# Altium project CANTRICK.PrjPcb
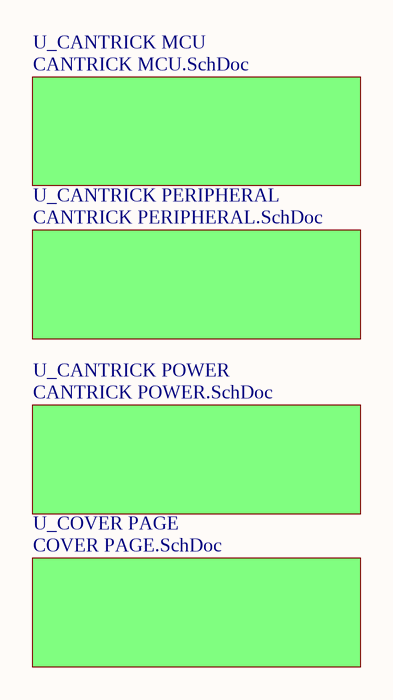
[diagram p0: OVERVIEW.SchDoc]
5 sheets, 104 parts. Net scope: flat (ports and power ports of the same name join across sheets).
Board file: CANTRICK.PcbDoc
Sheets:
  OVERVIEW.SchDoc
    U_CANTRICK MCU = CANTRICK MCU.SchDoc
    U_CANTRICK PERIPHERAL = CANTRICK PERIPHERAL.SchDoc
    U_CANTRICK POWER = CANTRICK POWER.SchDoc
    U_COVER PAGE = COVER PAGE.SchDoc

## Sheet OVERVIEW.SchDoc
size A4; SheetNumber: 1; SheetTotal: 5

### Sub-sheets
U_CANTRICK MCU = CANTRICK MCU.SchDoc: no entries
U_CANTRICK PERIPHERAL = CANTRICK PERIPHERAL.SchDoc: no entries
U_CANTRICK POWER = CANTRICK POWER.SchDoc: no entries
U_COVER PAGE = COVER PAGE.SchDoc: no entries

## Sheet CANTRICK MCU.SchDoc
size A4; SheetNumber: 4; SheetTotal: 5
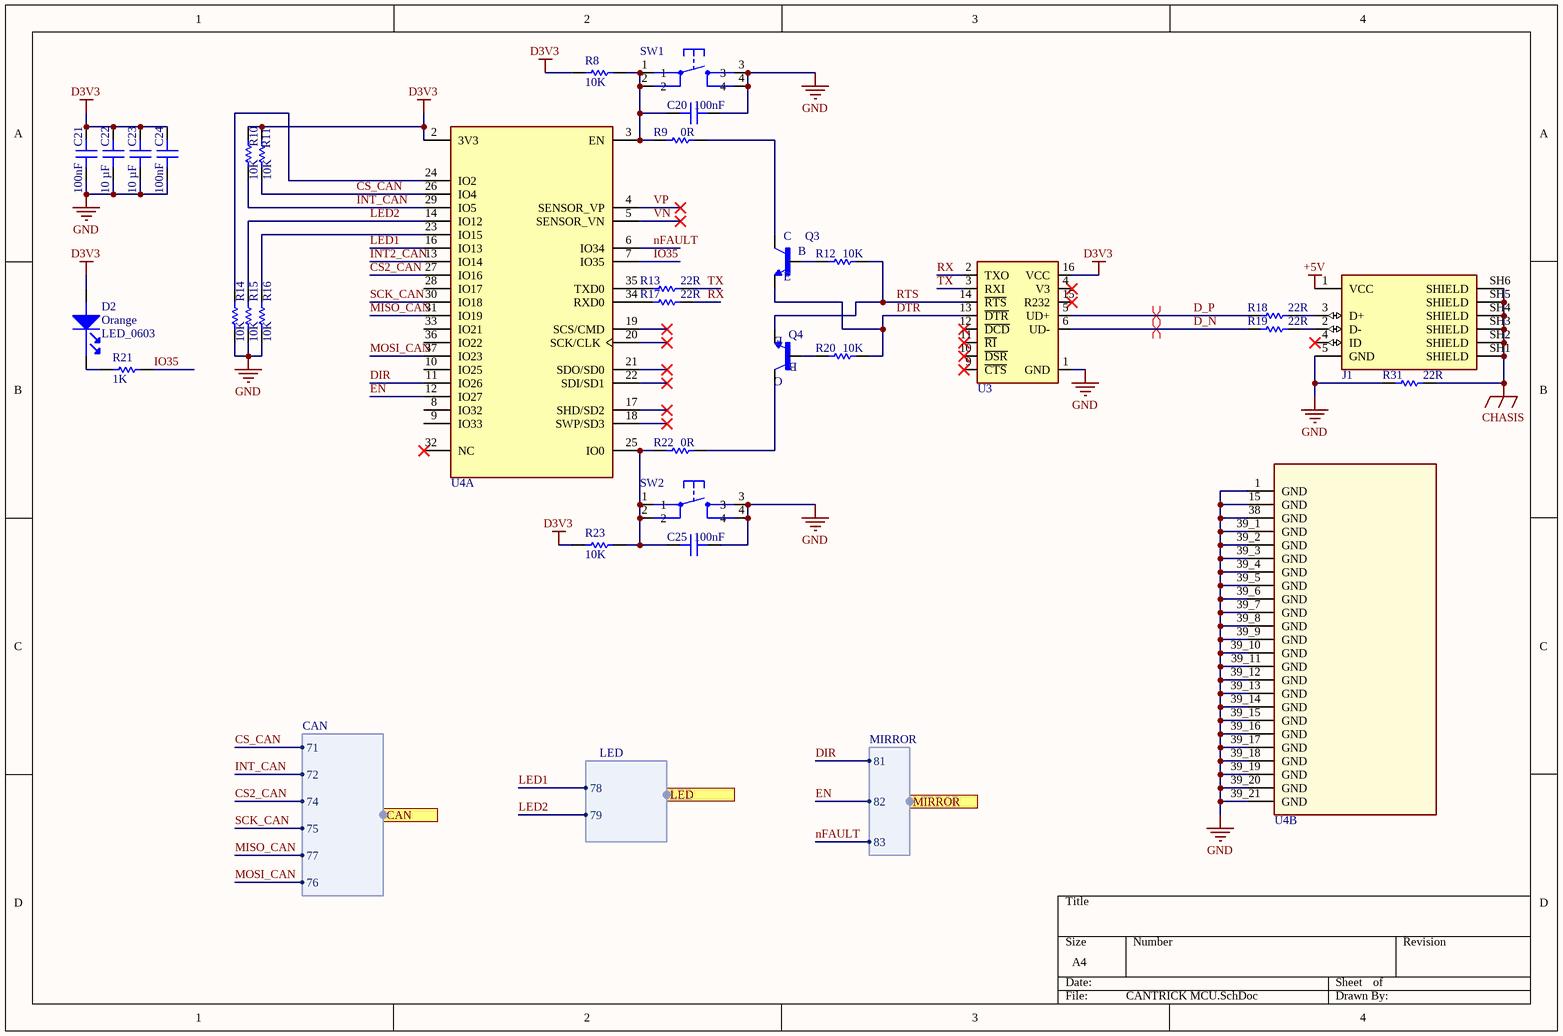
[diagram p1: CANTRICK MCU.SchDoc]

### Parts
C20  100nF  [CAP 0603]
C21  100nF  [CAP 0603]
C22  10 µF  [CAP 0603]
C23  10 µF  [CAP 0603]
C24  100nF  [CAP 0603]
C25  100nF  [CAP 0603]
D2  Orange  Package / Case: LED_0603  [LED]
J1  MICRO B  [MICRO USB B]  (value not drawn)
Q3  NMOS  [SOT23-3]  (value not drawn)
Q4  NMOS  [SOT23-3]  (value not drawn)
R8  10K  [Res 0603]
R9  0R  [Res 0603]
R10  10K  [Res 0603]
R11  10K  [Res 0603]
R12  10K  [Res 0603]
R13  22R  [Res 0603]
R14  10K  [Res 0603]
R15  10K  [Res 0603]
R16  10K  [Res 0603]
R17  22R  [Res 0603]
R18  22R  [Res 0603]
R19  22R  [Res 0603]
R20  10K  [Res 0603]
R21  1K  [Res 0603]
R22  0R  [Res 0603]
R23  10K  [Res 0603]
R31  22R  [Res 0603]
SW1  SW2  [SWITCH]  (value not drawn)
SW2  SW2  [SWITCH]  (value not drawn)
U3  CH340C  [CH340C]  (value not drawn)
U4  ESP32-WROOM-32UE-N8  [ESP32S]  (value not drawn)  (parts A,B of 2)

### Ports
CAN (harness CAN), LED (harness LED), MIRROR (harness MIRROR)

### Harnesses
CAN: 71, 72, 74, 75, 76, 77
LED: 78, 79
MIRROR: 81, 82, 83

### Nets
+5V: J1.1(VCC)
CHASIS: J1.SH1(SHIELD) J1.SH2(SHIELD) J1.SH3(SHIELD) J1.SH4(SHIELD) J1.SH5(SHIELD) J1.SH6(SHIELD) R31.2
D3V3: C21.2 C22.2 C23.2 C24.2 D2.1(ANODE) R8.1 R10.2 R11.2 R23.1 U3.16(VCC) U4.2(3V3)
GND: C20.1 C21.1 C22.1 C23.1 C24.1 C25.1 J1.5(GND) R14.1 R15.1 R16.1 R31.1 SW1.3 SW1.4 SW2.3 SW2.4 U3.1(GND) U4.1(GND) U4.15(GND) U4.38(GND) U4.39_1(GND) U4.39_2(GND) U4.39_3(GND) U4.39_4(GND) U4.39_5(GND) U4.39_6(GND) U4.39_7(GND) U4.39_8(GND) U4.39_9(GND) U4.39_10(GND) U4.39_11(GND) U4.39_12(GND) U4.39_13(GND) U4.39_14(GND) U4.39_15(GND) U4.39_16(GND) U4.39_17(GND) U4.39_18(GND) U4.39_19(GND) U4.39_20(GND) U4.39_21(GND)
CS2_CAN: U4.27(IO16) ; port CAN.74
CS_CAN: R11.1 U4.26(IO4) ; port CAN.71
D_N: R19.1 U3.6(UD-)
D_P: R18.1 U3.5(UD+)
DIR: U4.11(IO26) ; port MIRROR.81
DTR: Q3.2(E) R20.2 U3.13(~{DTR})
EN: U4.12(IO27) ; port MIRROR.82
INT2_CAN: U4.13(IO14)
INT_CAN: R10.1 U4.29(IO5) ; port CAN.72
IO35: R21.2 U4.7(IO35)
LED1: U4.16(IO13) ; port LED.78
LED2: R15.2 U4.14(IO12) ; port LED.79
MISO_CAN: U4.31(IO19) ; port CAN.77
MOSI_CAN: U4.37(IO23) ; port CAN.76
nFAULT: U4.6(IO34) ; port MIRROR.83
RTS: Q4.2(E) R12.2 U3.14(~{RTS})
RX: R17.2 U3.2(TXO)
SCK_CAN: U4.30(IO18) ; port CAN.75
TX: R13.2 U3.3(RXI)
VN: U4.5(SENSOR_VN)
VP: U4.4(SENSOR_VP)
NetC20_2: C20.2 R8.2 R9.1 SW1.1 SW1.2 U4.3(EN)
NetC25_2: C25.2 R22.1 R23.2 SW2.1 SW2.2 U4.25(IO0)
NetD2_2: D2.2(cathode) R21.1
NetJ1_2: J1.2(D-) R19.2
NetJ1_3: J1.3(D+) R18.2
NetQ3_1: Q3.1(B) R12.1
NetQ3_3: Q3.3(C) R9.2
NetQ4_1: Q4.1(B) R20.1
NetQ4_3: Q4.3(C) R22.2
NetR13_1: R13.1 U4.35(TXD0)
NetR14_2: R14.2 U4.24(IO2)
NetR16_2: R16.2 U4.23(IO15)
NetR17_1: R17.1 U4.34(RXD0)

Not connected (* = marked no-connect by the designer): J1 4(ID)*; U3 4(V3)* 9(~{CTS})* 10(~{DSR})* 11(~{RI})* 12(~{DCD})* 15(R232)*; U4 8(IO32) 9(IO33) 10(IO25) 17(SHD/SD2)* 18(SWP/SD3)* 19(SCS/CMD)* 20(SCK/CLK)* 21(SDO/SD0)* 22(SDI/SD1)* 28(IO17) 32(NC)* 33(IO21) 36(IO22)

### Layout directives
differential pair: D_N, D_P

### Library data of the parts
C20 C21 C24 C25 = GMC10X7R106K10NT: CAP0603 X7R 10UF 10% 10V; manufacturer: Cal-Chip Electronics, Inc.; Capacitance: 10 µF; Part Number: GMC10X7R106K10NT; Value: 100nF; Applications: General Purpose; componentlink1description: Datasheet; componentlink1url: https://88ce57.p3cdn1.secureserver.net/wp-content/uploads/2023/01/gmc_series-2.pdf; componentlink2description: DigiKey Link; componentlink2url: https://www.digikey.com/en/products/detail/cal-chip-electronics-inc/GMC10X7R106K10NT/18151126; Device Package: 0603 (1608 Metric); lastupdated: 2/9/2024 8:09:39 PM; Lifecycle Status: Active; Minimum Order: 1; Mounting Type: Surface Mount, MLCC; Operating Temperature: -55°C ~ 125°C; Package / Case: 0603 (1608 Metric); packaging: TapeAndReel; partid: 49835; Part Status: Active; price: 0.26; series: GMC; Size / Dimension: 0.063" L x 0.031" W (1.60mm x 0.80mm); Supplier 1: DigiKey; Supplier Part Number 1: 4713-GMC10X7R106K10NTCT-ND; Temperature Coefficient: X7R; Thickness (Max): 0.039" (1.00mm); Tolerance: ±10%; Voltage - Rated: 10V
C22 C23 = GMC10X7R106K10NT: CAP0603 X7R 10UF 10% 10V; manufacturer: Cal-Chip Electronics, Inc.; Part Number: GMC10X7R106K10NT; Value: 10 µF; Applications: General Purpose; Capacitance: 10 µF; componentlink1description: Datasheet; componentlink1url: https://88ce57.p3cdn1.secureserver.net/wp-content/uploads/2023/01/gmc_series-2.pdf; componentlink2description: DigiKey Link; componentlink2url: https://www.digikey.com/en/products/detail/cal-chip-electronics-inc/GMC10X7R106K10NT/18151126; Device Package: 0603 (1608 Metric); lastupdated: 2/9/2024 8:09:39 PM; Lifecycle Status: Active; Minimum Order: 1; Mounting Type: Surface Mount, MLCC; Operating Temperature: -55°C ~ 125°C; Package / Case: 0603 (1608 Metric); packaging: TapeAndReel; partid: 49835; Part Status: Active; price: 0.26; series: GMC; Size / Dimension: 0.063" L x 0.031" W (1.60mm x 0.80mm); Supplier 1: DigiKey; Supplier Part Number 1: 4713-GMC10X7R106K10NTCT-ND; Temperature Coefficient: X7R; Thickness (Max): 0.039" (1.00mm); Tolerance: ±10%; Voltage - Rated: 10V
D2 = LED ORANGE 606NM 0603: LED SMARTLED ORANGE 606NM 0603; Manufacturer: OSRAM Opto Semiconductors Inc; Manufacturer Part Number: LO L29K-H2K1-24-Z; Millicandela Rating: 6.3mcd; Voltage - Forward (Vf) Typ: 1.8V; Current - Test: 2mA; Wavelength - Peak: 610nm; Viewing Angle: 160°; Lens Type: Diffused; Lens Style/Size: Rectangle with Flat Top, 1.3mm x 0.8mm; Luminous Flux @ Current - Test: 25 mlm; By: Hieu.Nguyen_20191030; Supplier 1: Digi-Key; Supplier Part Number 1: 475-2740-1-ND; RoHS: RoHS Compliant; Category: Optoelectronics; Stock 1: 15900; Pricing 1: 1=0.17, 10=0.141, 100=0.1127, 250=0.0986, 500=0.09016 (USD); Color: Orange; Wavelength - Dominant: 606nm; Size / Dimension: 1.70mm L x 0.80mm W; Height: 0.65mm; Mounting Type: Surface Mount; Packaging: Cut Tape (CT); ComponentLink1URL: http://catalog.osram-os.com/catalogue/catalogue.do;jsessionid=302CF83AF637AE24E40AEB0ADA267EDD?act=downloadFile&favOid=020000010003f9de000100b6; ComponentLink1Description: http://catalog.osram-os.com/catalogue/catalogue.do;jsessionid=302CF83AF637AE24E40AEB0ADA267EDD?act=downloadFile&favOid=020000010003f9de000100b6
J1 = MICRO USB B
Q3 Q4 = MMBT3904: MMBT3904 Series 40 V CE Breakdown 0.2 A NPN General Purpose Amplifier - SOT-23; Manufacturer: onsemi; Collector Emitter Voltage (VCEO): 40V; hFE Min: 100; Max Power Dissipation: 350mW; Max Collector Current: 200mA; Transition Frequency: 300MHz; Collector Base Voltage (VCBO): 60V; Emitter Base Voltage (VEBO): 6V; Collector Emitter Saturation Voltage: 300mV; Supplier 1: Farnell; Manufacturer Part Number: MMBT3904; RoHS: Yes; Category: BJTs; Pricing 1: 5=0,136, 25=0,133, 100=0,0476, 250=0,0435, 500=0,043, 1000=0,022, 5000=0,02 (GBP); Mount: Surface Mount; Case/Package: SOT-23; Number of Pins: 3; Weight: 0.03g; Min Operating Temperature: -55°C; Max Operating Temperature: 150°C; Packaging: Tape and Reel; Polarity: NPN; Collector Emitter Breakdown Voltage: 40V; Voltage Rating (DC): 40V; Package Quantity: 1; Max Breakdown Voltage: 40V; Current Rating: 200mA; Series: -; Collector-emitter Voltage-Max: 300mV; Termination: SMD/SMT; Radiation Hardening: No; RoHS Compliant: Yes; Reach SVHC Compliant: No; Lead Free: Lead Free; Supplier Part Number 1: 9846727
R8-R23 R31 = Resistor 2.2K: Res Thick Film 0603 2.2K Ohm 5% 1/10W ±200ppm/°C Molded SMD SMD Paper T/R; Manufacturer: Vishay; Manufacturer Part Number: CRCW06032K20JNEA; Resistance: 2.2kR; Power Rating: 100mW; Voltage Rating: 75V; Supplier 1: Arrow Electronics; RoHS: Yes; Category: Chip SMD Resistors; Stock 1: 130000; Pricing 1: 5000=0.0053 (USD); Case/Package: 0603; Weight: 7.1E-05oz; Case Code (Metric): 1608; Case Code (Imperial): 0603; Contact Plating: Tin; Size Code: 0603; Min Operating Temperature: -55°C; Max Operating Temperature: 155°C; Package Quantity: 5000; Tolerance: 5%; Packaging: Tape and Reel; Resistor Type: Thick Film; Number of Terminations: 2; Temperature Coefficient: 200ppm/°C; Termination: SMD/SMT; Max Power Dissipation: 100mW; Features: Automotive AEC-Q200; Series: CRCW; Resistance Tolerance: 5%; Construction: Rectangular; Length: 1.55mm; Width: 0.85mm; Height: 0.45mm; Depth: 0.85mm; Ratings: AEC-Q200; Radiation Hardening: No; Military Standard: Not; RoHS Compliant: Yes; Reach SVHC Compliant: Unknown; Lead Free: 5697LeadFree; ComponentLink1URL: https://datasheet.ciiva.com/2462/dcrcwe3-2462048.pdf?src-supplier=Digikey; ComponentLink1Description: https://datasheet.ciiva.com/2462/dcrcwe3-2462048.pdf?src-supplier=Digikey; ComponentLink2URL: https://datasheet.ciiva.com/16767/70201119-16767464.pdf?src-supplier=Allied+Electronics; ComponentLink2Description: https://datasheet.ciiva.com/16767/70201119-16767464.pdf?src-supplier=Allied+Electronics; ComponentLink3URL: https://datasheet.ciiva.com/2462/dcrcwe3-2462046.pdf?src-supplier=Digikey; ComponentLink3Description: https://datasheet.ciiva.com/2462/dcrcwe3-2462046.pdf?src-supplier=Digikey; ComponentLink4URL: https://datasheet.ciiva.com/5541/dcrcwe3-109170-5541959.pdf?src-supplier=Mouser; ComponentLink4Description: https://datasheet.ciiva.com/5541/dcrcwe3-109170-5541959.pdf?src-supplier=Mouser; ComponentLink5URL: https://datasheet.ciiva.com/16286/dcrcwe3-16286997.pdf?src-supplier=Future+Electronics; ComponentLink5Description: https://datasheet.ciiva.com/16286/dcrcwe3-16286997.pdf?src-supplier=Future+Electronics; Supplier Part Number 1: CRCW06032K20JNEA
SW1 SW2 = SW2: Switch button 4 pin
U4 = ESP32-WROOM-32UE-N8: Multiprotocol Modules SMD module ESP32-WROOM-32UE, ESP32-D0WD-V3, ESP32 ECO V3,; Manufacturer: Espressif Systems; Supplier 1: Digikey; Manufacturer Part Number: ESP32-WROOM-32UE-N8; RoHS: No; Category: LDO; Stock 1: 3266; Pricing 1: 1=5,28, 10=4,566, 25=4,3196, 100=3,9802, 250=3,7768 (USD); ComponentLink1URL: https://datasheet.octopart.com/ESP32-WROOM-32UE-N8-Espressif-Systems-datasheet-188867343.pdf?src-supplier=TME; ComponentLink1Description: https://datasheet.octopart.com/ESP32-WROOM-32UE-N8-Espressif-Systems-datasheet-188867343.pdf?src-supplier=TME; Supplier Part Number 1: 1965-ESP32-WROOM-32UE-N8CT-ND

## Sheet CANTRICK PERIPHERAL.SchDoc
size A4; SheetNumber: 5; SheetTotal: 5
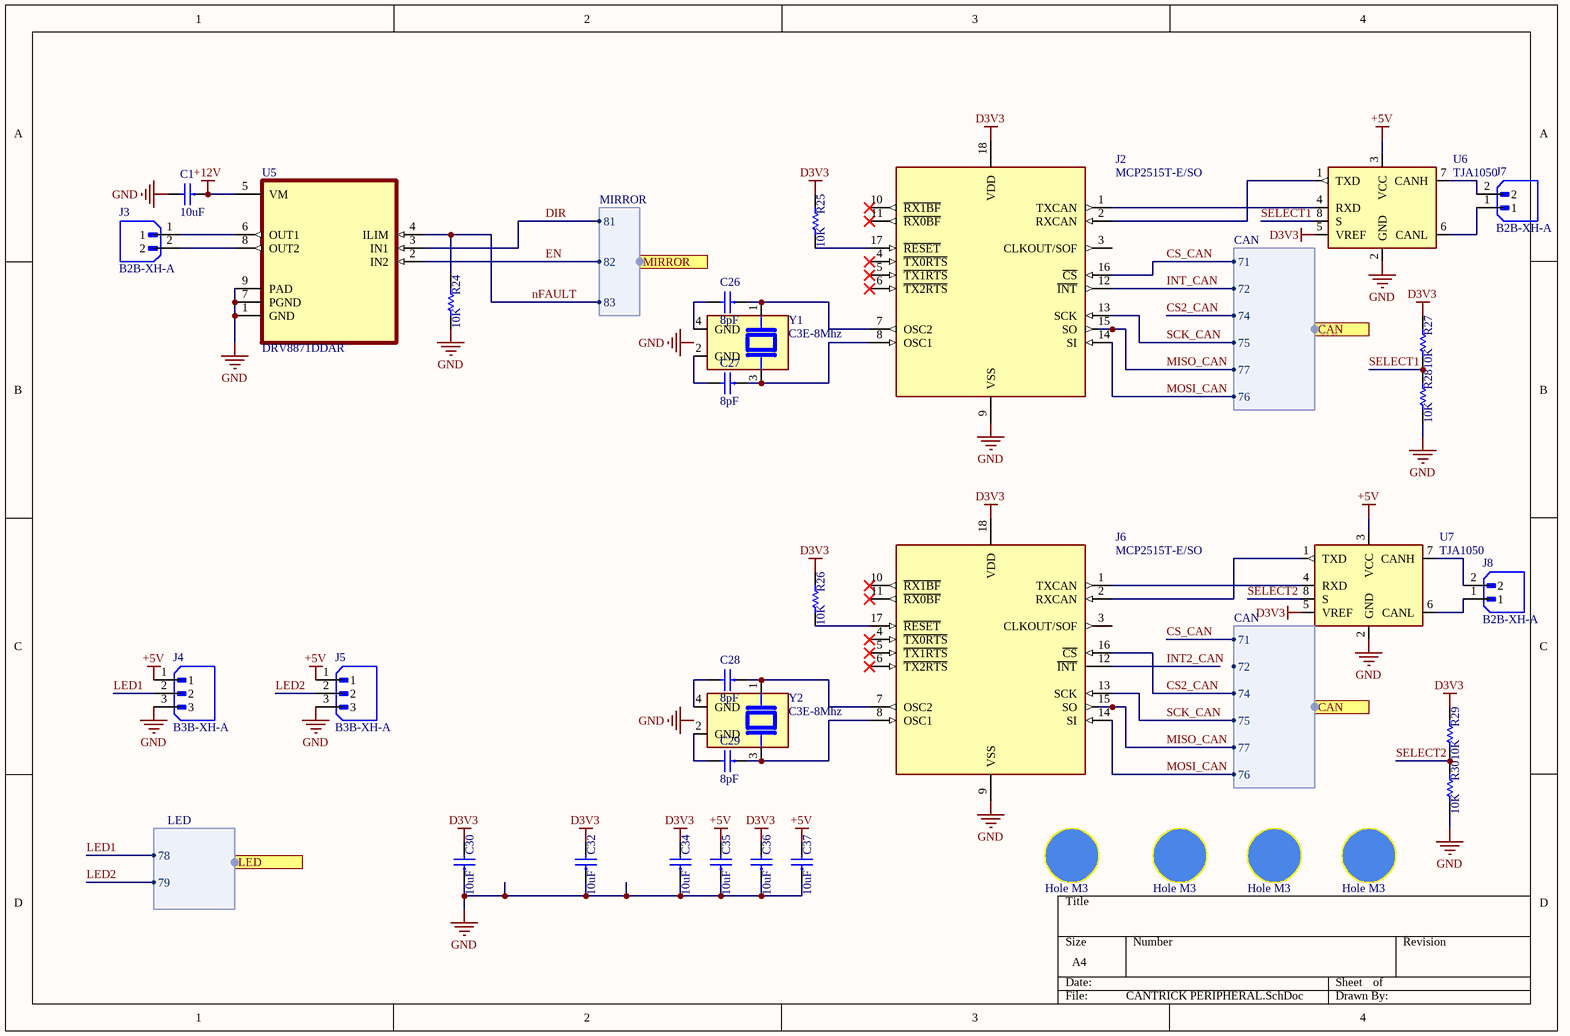
[diagram p2: CANTRICK PERIPHERAL.SchDoc]

### Parts
*1  Hole M3  [M3]
*2  Hole M3  [M3]
*3  Hole M3  [M3]
*4  Hole M3  [M3]
C1  10uF  [CAP-CER0603-0.8H]
C26  8pF  [CAP-CER0402-0.5H]
C27  8pF  [CAP-CER0402-0.5H]
C28  8pF  [CAP-CER0402-0.5H]
C29  8pF  [CAP-CER0402-0.5H]
C30  10uF  [CAP-CER0603-0.8H]
C32  10uF  [CAP-CER0603-0.8H]
C34  10uF  [CAP-CER0603-0.8H]
C35  10uF  [CAP-CER0603-0.8H]
C36  10uF  [CAP-CER0603-0.8H]
C37  10uF  [CAP-CER0603-0.8H]
J2  MCP2515T-E/SO  [SOIC127P1030X265-18N]
J3  B2B-XH-A  [JST_B2B-XH-A]
J4  B3B-XH-A  [JST_B3B-XH-A]
J5  B3B-XH-A  [JST_B3B-XH-A]
J6  MCP2515T-E/SO  [SOIC127P1030X265-18N]
J7  B2B-XH-A  [JST_B2B-XH-A]
J8  B2B-XH-A  [JST_B2B-XH-A]
R24  10K  [Res 0603]
R25  10K  [Res 0603]
R26  10K  [Res 0603]
R27  10K  [Res 0603]
R28  10K  [Res 0603]
R29  10K  [Res 0603]
R30  10K  [Res 0603]
U5  DRV8871DDAR  [VREG_LM5017MR/NOPB]
U6  TJA1050  [SOT96-1]
U7  TJA1050  [SOT96-1]
Y1  C3E-8Mhz  [XTAL_C3E-8.000-8-1015-R]
Y2  C3E-8Mhz  [XTAL_C3E-8.000-8-1015-R]

### Ports
CAN (harness CAN), LED (harness LED), MIRROR (harness MIRROR)

### Harnesses
CAN: 71, 72, 74, 75, 76, 77
LED: 78, 79
MIRROR: 81, 82, 83

### Nets
+5V: C35.2 C37.2 J4.1 J5.1 U6.3(VCC) U7.3(VCC)
+12V: C1.1 U5.5(VM)
D3V3: C30.2 C32.2 C34.2 C36.2 J2.18(VDD) J6.18(VDD) R25.2 R26.2 R27.2 R29.2 U6.5(VREF) U7.5(VREF)
GND: C1.2 C30.1 C32.1 C34.1 C35.1 C36.1 C37.1 J2.9(VSS) J4.3 J5.3 J6.9(VSS) R24.1 R28.1 R30.1 U5.1(GND) U5.7(PGND) U5.9(PAD) U6.2(GND) U7.2(GND)
CS2_CAN: J6.16(~{CS}) ; port CAN.74
CS_CAN: J2.16(~{CS}) ; port CAN.71
DIR: U5.3(IN1) ; port MIRROR.81
EN: U5.2(IN2) ; port MIRROR.82
INT2_CAN: J6.12(~{INT})
INT_CAN: J2.12(~{INT}) ; port CAN.72
LED1: J4.2 ; port LED.78
LED2: J5.2 ; port LED.79
MISO_CAN: J2.15(SO) J6.15(SO) ; port CAN.77
MOSI_CAN: J2.14(SI) J6.14(SI) ; port CAN.76
nFAULT: R24.2 U5.4(ILIM) ; port MIRROR.83
SCK_CAN: J2.13(SCK) J6.13(SCK) ; port CAN.75
SELECT1: R27.1 R28.2 U6.8(S)
SELECT2: R29.1 R30.2 U7.8(S)
NetC26_1: C26.1 J2.7(OSC2) Y1.1
NetC26_2: C26.2 Y1.4(GND)
NetC27_1: C27.1 J2.8(OSC1) Y1.3
NetC27_2: C27.2 Y1.2(GND)
NetC28_1: C28.1 J6.7(OSC2) Y2.1
NetC28_2: C28.2 Y2.4(GND)
NetC29_1: C29.1 J6.8(OSC1) Y2.3
NetC29_2: C29.2 Y2.2(GND)
NetJ2_1: J2.1(TXCAN) U6.4(RXD)
NetJ2_2: J2.2(RXCAN) U6.1(TXD)
NetJ2_17: J2.17(~{RESET}) R25.1
NetJ3_1: J3.1 U5.6(OUT1)
NetJ3_2: J3.2 U5.8(OUT2)
NetJ6_1: J6.1(TXCAN) U7.4(RXD)
NetJ6_2: J6.2(RXCAN) U7.1(TXD)
NetJ6_17: J6.17(~{RESET}) R26.1
NetJ7_1: J7.1 U6.6(CANL)
NetJ7_2: J7.2 U6.7(CANH)
NetJ8_1: J8.1 U7.6(CANL)
NetJ8_2: J8.2 U7.7(CANH)

Not connected (* = marked no-connect by the designer): J2 3(CLKOUT/SOF) 4(~{TX0RTS})* 5(~{TX1RTS})* 6(~{TX2RTS})* 10(~{RX1BF})* 11(~{RX0BF})*; J6 3(CLKOUT/SOF) 4(~{TX0RTS})* 5(~{TX1RTS})* 6(~{TX2RTS})* 10(~{RX1BF})* 11(~{RX0BF})*

### Notes on the sheet
- Labels drawn without touching a wire or pin: GND

### Library data of the parts
C1 C30 C32 C34-C37 = CAPCER0001 100nF 10% 50V X7R 0603 SMD: CAP CER 100nF 10% 50V X7R 0603 SMD; LINE: SMT; TYPE: EP; UNIT: PCS; TMG CODE: None; CERTIFICATION: NA; CLASS: B; MOUNT: SMD; TMG PN: CAPCER0001; ComponentLink1Description: Datasheet; ComponentLink1URL: https://datasheet.lcsc.com/lcsc/1811021431_Samsung-Electro-Mechanics-CL10B104KB8NNNC_C1591.pdf; Footprint: 0603
C26-C29 = CAPCER0013 100nF 10% 50V X7R 0402 SMD: CAP CER 100nF 10% 50V X7R 0402 SMD; LINE: SMT; TYPE: EP; UNIT: PCS; TMG CODE: None; CERTIFICATION: NA; CLASS: B; MOUNT: SMD; TMG PN: CAPCER0013; ComponentLink1Description: Datasheet; ComponentLink1URL: https://datasheet.lcsc.com/lcsc/1811021431_Samsung-Electro-Mechanics-CL10B104KB8NNNC_C1591.pdf; Footprint: 0402
J2 J6 = MCP2515T-E/SO: CAN controller w/ SPI interface, 125 deg C18 SOIC .300in T/R | Microchip Technology Inc. MCP2515T-E/SO; SnapEDA_Link: https://www.snapeda.com/parts/MCP2515T-E/SO/Microchip/view-part/?ref=snap; Package: SOIC-18 Microchip; Value: *; MF: Microchip; MP: MCP2515T-E/SO; Check_prices: https://www.snapeda.com/parts/MCP2515T-E/SO/Microchip/view-part/?ref=eda
J3 J7 J8 = B2B-XH-A: MF: {'manufacturer': u'JST Sales America Inc.'}; Package: None; Price: None; Value: *; MP: B2B-XH-A; Availability: Unavailable
J4 J5 = B3B-XH-A: Connector Header Through Hole 3 position 0.098 (2.50mm); MF: JST Sales; SnapEDA_Link: https://www.snapeda.com/parts/B3B-XH-A/JST+Sales+America+Inc./view-part/?ref=snap; Package: None; Value: *; MP: B3B-XH-A; Check_prices: https://www.snapeda.com/parts/B3B-XH-A/JST+Sales+America+Inc./view-part/?ref=eda
R24-R30 = Resistor 2.2K: as R8 on sheet CANTRICK MCU; Supplier 1: Arrow Electronics; RoHS: Yes; Category: Chip SMD Resistors; Stock 1: 130000; Pricing 1: 5000=0.0053 (USD); Case/Package: 0603; Weight: 7.1E-05oz; Case Code (Metric): 1608; Case Code (Imperial): 0603; Contact Plating: Tin; Size Code: 0603; Min Operating Temperature: -55°C; Max Operating Temperature: 155°C; Package Quantity: 5000; Tolerance: 5%; Packaging: Tape and Reel; Resistor Type: Thick Film; Number of Terminations: 2; Temperature Coefficient: 200ppm/°C; Termination: SMD/SMT; Max Power Dissipation: 100mW; Features: Automotive AEC-Q200; Series: CRCW; Resistance Tolerance: 5%; Construction: Rectangular; Length: 1.55mm; Width: 0.85mm; Height: 0.45mm; Depth: 0.85mm; Ratings: AEC-Q200; Radiation Hardening: No; Military Standard: Not; RoHS Compliant: Yes; Reach SVHC Compliant: Unknown; Lead Free: 5697LeadFree; ComponentLink1URL: https://datasheet.ciiva.com/2462/dcrcwe3-2462048.pdf?src-supplier=Digikey; ComponentLink1Description: https://datasheet.ciiva.com/2462/dcrcwe3-2462048.pdf?src-supplier=Digikey; ComponentLink2URL: https://datasheet.ciiva.com/16767/70201119-16767464.pdf?src-supplier=Allied+Electronics; ComponentLink2Description: https://datasheet.ciiva.com/16767/70201119-16767464.pdf?src-supplier=Allied+Electronics; ComponentLink3URL: https://datasheet.ciiva.com/2462/dcrcwe3-2462046.pdf?src-supplier=Digikey; ComponentLink3Description: https://datasheet.ciiva.com/2462/dcrcwe3-2462046.pdf?src-supplier=Digikey; ComponentLink4URL: https://datasheet.ciiva.com/5541/dcrcwe3-109170-5541959.pdf?src-supplier=Mouser; ComponentLink4Description: https://datasheet.ciiva.com/5541/dcrcwe3-109170-5541959.pdf?src-supplier=Mouser; ComponentLink5URL: https://datasheet.ciiva.com/16286/dcrcwe3-16286997.pdf?src-supplier=Future+Electronics; ComponentLink5Description: https://datasheet.ciiva.com/16286/dcrcwe3-16286997.pdf?src-supplier=Future+Electronics; Supplier Part Number 1: CRCW06032K20JNEA
U5 = DRV8871DDAR: 50-V, 3.6-A H-bridge motor driver with integrated current sensing; MF: Texas Instruments; SnapEDA_Link: https://www.snapeda.com/parts/DRV8871DDAR/Texas+Instruments/view-part/?ref=snap; Package: HSOIC-8 Texas Instruments; Value: *; MP: DRV8871DDAR; Check_prices: https://www.snapeda.com/parts/DRV8871DDAR/Texas+Instruments/view-part/?ref=eda
U6 U7 = TJA1050: CAN 1MBd Silent 5V Automotive 8-Pin SO T/R; MF: NXP Semiconductors; SnapEDA_Link: https://www.snapeda.com/parts/TJA1050/NXP+Semiconductors/view-part/?ref=snap; Package: None; Value: *; MP: TJA1050; Check_prices: https://www.snapeda.com/parts/TJA1050/NXP+Semiconductors/view-part/?ref=eda
Y1 Y2 = C3E-8.000-8-1015-R: Package: None; Price: None; Value: *; MP: C3E-8.000-8-1015-R; Availability: Unavailable

## Sheet CANTRICK POWER.SchDoc
size A4; SheetNumber: 3; SheetTotal: 5
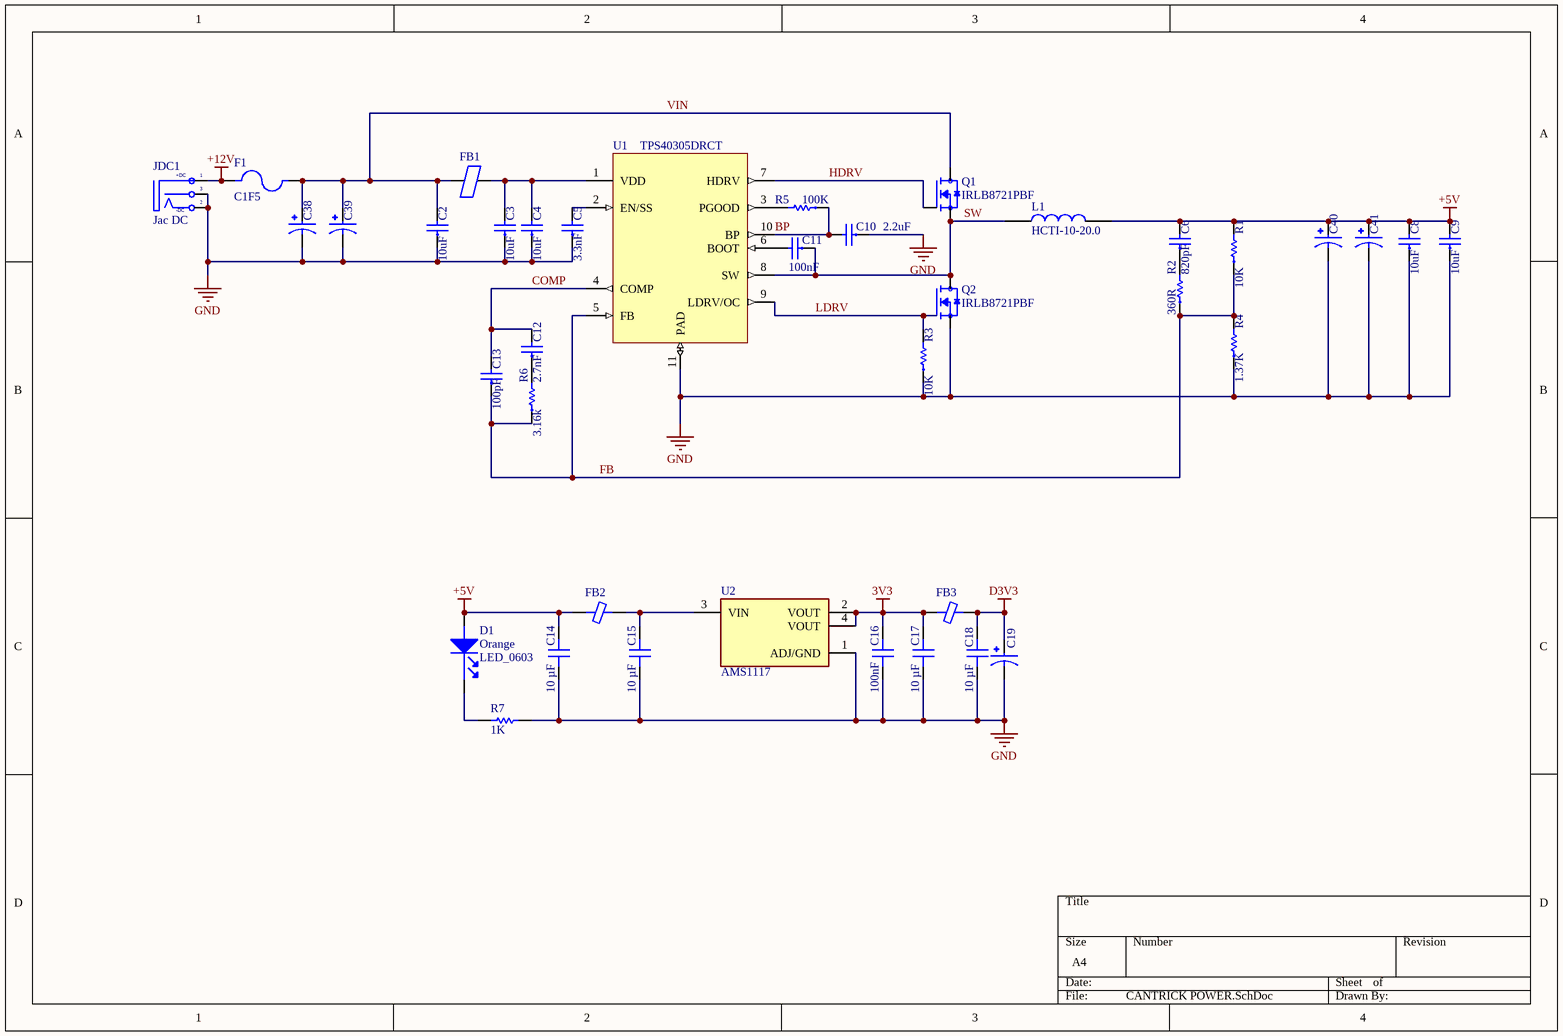
[diagram p3: CANTRICK POWER.SchDoc]

### Parts
C2  10uF  [CAP-CER0603-0.8H]
C3  10uF  [CAP-CER0603-0.8H]
C4  10uF  [CAP-CER0603-0.8H]
C5  3.3nF  [CAP-CER0603-0.8H]
C6  820pF  [CAP-CER0603-0.8H]
C8  10uF  [CAP-CER0603-0.8H]
C9  10uF  [CAP-CER0603-0.8H]
C10  2.2uF  [CAP-CER0603-0.8H]
C11  100nF  [CAP-CER0603-0.8H]
C12  2.7nF  [CAP-CER0603-0.8H]
C13  100pF  [CAP-CER0603-0.8H]
C14  10 µF  [CAP 0603]
C15  10 µF  [CAP 0603]
C16  100nF  [CAP 0603]
C17  10 µF  [CAP 0603]
C18  10 µF  [CAP 0603]
C19  ECA1CHG331  [330UF-5mm]  (value not drawn)
C38  EEUFC1V222  [CAPPRD750W80D1600H3150]  (value not drawn)
C39  EEUFC1V222  [CAPPRD750W80D1600H3150]  (value not drawn)
C40  EEUFC1V222  [CAPPRD750W80D1600H3150]  (value not drawn)
C41  EEUFC1V222  [CAPPRD750W80D1600H3150]  (value not drawn)
D1  Orange  Package / Case: LED_0603  [LED]
F1  C1F5  [FUSE C1F5]
FB1  100MHz 2A 50mOhm  [FB 0603]  (value not drawn)
FB2  330 Ohms @ 100 MHz  [FB_0603]  (value not drawn)
FB3  330 Ohms @ 100 MHz  [FB_0603]  (value not drawn)
JDC1  Jac DC  [DC0]
L1  HCTI-10-20.0  [IND_HCTI-10-20.0]
Q1  IRLB8721PBF  [TO254P1067X483X2057-3]
Q2  IRLB8721PBF  [TO254P1067X483X2057-3]
R1  10K  [RES-CHP0603-0.45H-101]
R2  360R  [RES-CHP0603-0.45H-101]
R3  10K  [RES-CHP0603-0.45H-101]
R4  1.37K  [RES-CHP0603-0.45H-101]
R5  100K  [RES-CHP0603-0.45H-101]
R6  3.16k  [RES-CHP0603-0.45H-101]
R7  1K  [Res 0603]
U1  TPS40305DRCT  [VREG_V62/16624-01YE]
U2  AMS1117  [AMS1117]

### Nets
3V3: C16.2 C17.2 FB3.1 U2.2(VOUT) U2.4(VOUT)
+5V: C6.2 C8.2 C9.2 C14.2 C40.P C41.P D1.1(ANODE) FB2.1 L1.2 R1.2
+12V: F1.1 JDC1.1(T)
D3V3: C18.2 C19.1 FB3.2
GND: C2.1 C3.1 C4.1 C5.1 C8.1 C9.1 C10.1 C14.1 C15.1 C16.1 C17.1 C18.1 C19.2 C38.N C39.N C40.N C41.N JDC1.2(TN) JDC1.3(S) Q2.3(S) R3.1 R4.1 R7.2 U1.11(PAD) U2.1(ADJ/GND)
BP: C10.2 R5.1 U1.10(BP)
COMP: C12.2 C13.2 U1.4(COMP)
FB: C13.1 R1.1 R2.1 R4.2 R6.1 U1.5(FB)
HDRV: Q1.1(G) U1.7(HDRV)
LDRV: Q2.1(G) R3.2 U1.9(LDRV/OC)
SW: C11.1 L1.1 Q1.3(S) Q2.2(D) U1.8(SW)
VIN: C2.2 C38.P C39.P F1.2 FB1.1 Q1.2(D)
NetC3_2: C3.2 C4.2 FB1.2 U1.1(VDD)
NetC5_2: C5.2 U1.2(EN/SS)
NetC6_1: C6.1 R2.2
NetC11_2: C11.2 U1.6(BOOT)
NetC12_1: C12.1 R6.2
NetC15_2: C15.2 FB2.2 U2.3(VIN)
NetD1_2: D1.2(cathode) R7.1
NetR5_2: R5.2 U1.3(PGOOD)

### Notes on the sheet
- (in symbol DCIN) +DC; -DC

### Library data of the parts
C2-C6 C8-C13 = CAPCER0001 100nF 10% 50V X7R 0603 SMD: as C1 on sheet CANTRICK PERIPHERAL; MOUNT: SMD; TMG PN: CAPCER0001; ComponentLink1Description: Datasheet; ComponentLink1URL: https://datasheet.lcsc.com/lcsc/1811021431_Samsung-Electro-Mechanics-CL10B104KB8NNNC_C1591.pdf; Footprint: 0603
C14 C15 C17 C18 = GMC10X7R106K10NT: as C22 on sheet CANTRICK MCU; Part Number: GMC10X7R106K10NT; Value: 10 µF; Applications: General Purpose; Capacitance: 10 µF; componentlink1description: Datasheet; componentlink1url: https://88ce57.p3cdn1.secureserver.net/wp-content/uploads/2023/01/gmc_series-2.pdf; componentlink2description: DigiKey Link; componentlink2url: https://www.digikey.com/en/products/detail/cal-chip-electronics-inc/GMC10X7R106K10NT/18151126; Device Package: 0603 (1608 Metric); lastupdated: 2/9/2024 8:09:39 PM; Lifecycle Status: Active; Minimum Order: 1; Mounting Type: Surface Mount, MLCC; Operating Temperature: -55°C ~ 125°C; Package / Case: 0603 (1608 Metric); packaging: TapeAndReel; partid: 49835; Part Status: Active; price: 0.26; series: GMC; Size / Dimension: 0.063" L x 0.031" W (1.60mm x 0.80mm); Supplier 1: DigiKey; Supplier Part Number 1: 4713-GMC10X7R106K10NTCT-ND; Temperature Coefficient: X7R; Thickness (Max): 0.039" (1.00mm); Tolerance: ±10%; Voltage - Rated: 10V
C16 = GMC10X7R106K10NT: as C20 on sheet CANTRICK MCU; Part Number: GMC10X7R106K10NT; Value: 100nF; Applications: General Purpose; componentlink1description: Datasheet; componentlink1url: https://88ce57.p3cdn1.secureserver.net/wp-content/uploads/2023/01/gmc_series-2.pdf; componentlink2description: DigiKey Link; componentlink2url: https://www.digikey.com/en/products/detail/cal-chip-electronics-inc/GMC10X7R106K10NT/18151126; Device Package: 0603 (1608 Metric); lastupdated: 2/9/2024 8:09:39 PM; Lifecycle Status: Active; Minimum Order: 1; Mounting Type: Surface Mount, MLCC; Operating Temperature: -55°C ~ 125°C; Package / Case: 0603 (1608 Metric); packaging: TapeAndReel; partid: 49835; Part Status: Active; price: 0.26; series: GMC; Size / Dimension: 0.063" L x 0.031" W (1.60mm x 0.80mm); Supplier 1: DigiKey; Supplier Part Number 1: 4713-GMC10X7R106K10NTCT-ND; Temperature Coefficient: X7R; Thickness (Max): 0.039" (1.00mm); Tolerance: ±10%; Voltage - Rated: 10V
C19 = ECA1CHG331: Cap Aluminum 330uF 16V 20% (8 X 11.5mm) Radial Aluminum Cylindrical Can 3.5mm 260mA 1000 hr 105C Bulk; MP: ECA-1CHG331; MF: Panasonic; Availability: In Stock; Package: RADIAL-2 Panasonic; Check_prices: https://www.snapeda.com/parts/ECA-1CHG331/Panasonic/view-part/?ref=eda; Price: None; SnapEDA_Link: https://www.snapeda.com/parts/ECA-1CHG331/Panasonic/view-part/?ref=snap; Value: *; Purchase-URL: https://pricing.snapeda.com/search/part/ECA-1CHG331/?ref=eda
C38-C41 = EEUFC1V222: 2200ÂµF 35V Aluminum Electrolytic Capacitors Radial, Can 5000 Hrs @ 105Â°C; MF: Panasonic; Check_prices: https://www.snapeda.com/parts/EEUFC1V222/Panasonic/view-part/5783312/?ref=eda; SnapEDA_Link: https://www.snapeda.com/parts/EEUFC1V222/Panasonic/view-part/5783312/?ref=snap; Availability: No availability data; MP: EEUFC1V222; Package: RADIAL-2 Panasonic; Price: None; Value: *
D1 = LED ORANGE 606NM 0603: as D2 on sheet CANTRICK MCU; Supplier 1: Digi-Key; Supplier Part Number 1: 475-2740-1-ND; RoHS: RoHS Compliant; Category: Optoelectronics; Stock 1: 15900; Pricing 1: 1=0.17, 10=0.141, 100=0.1127, 250=0.0986, 500=0.09016 (USD); Color: Orange; Wavelength - Dominant: 606nm; Size / Dimension: 1.70mm L x 0.80mm W; Height: 0.65mm; Mounting Type: Surface Mount; Packaging: Cut Tape (CT); ComponentLink1URL: http://catalog.osram-os.com/catalogue/catalogue.do;jsessionid=302CF83AF637AE24E40AEB0ADA267EDD?act=downloadFile&favOid=020000010003f9de000100b6; ComponentLink1Description: http://catalog.osram-os.com/catalogue/catalogue.do;jsessionid=302CF83AF637AE24E40AEB0ADA267EDD?act=downloadFile&favOid=020000010003f9de000100b6
F1 = C1F5: Fuse Chip Fast Acting 5A 125V SMD Solder Pad 1206 3.2 X 1.58 X 0.63mm; Manufacturer: Bel TRP; Voltage Rating (DC): 63V; DC Cold Resistance: 20mR; Fuse Type: Board Mount (Cartridge Style Excluded); Supplier 1: Newark; Manufacturer Part Number: C1F5; RoHS: Yes; Category: Uncategorized; Mount: Surface Mount; Case/Package: 1206; Number of Pins: 2; Contact Plating: Tin; Case Code (Metric): 3216; Case Code (Imperial): 1206; Min Operating Temperature: -55°C; Max Operating Temperature: 125°C; Packaging: Cut Tape; Voltage Rating: 125V; Series: C1F; Voltage Rating (AC): 125V; ComponentLink1URL: http://www.mouser.com/ds/2/643/C1F-594910.pdf?src-supplier=Mouser; ComponentLink1Description: http://www.mouser.com/ds/2/643/C1F-594910.pdf?src-supplier=Mouser; ComponentLink2URL: http://belfuse.com/pdfs/C1F.pdf?src-supplier=Avnet; ComponentLink2Description: http://belfuse.com/pdfs/C1F.pdf?src-supplier=Avnet; ComponentLink3URL: https://belfuse.com/resources/datasheets/circuitprotection/ds-cp-c1f-series.pdf?src-supplier=Digikey; ComponentLink3Description: https://belfuse.com/resources/datasheets/circuitprotection/ds-cp-c1f-series.pdf?src-supplier=Digikey; Supplier Part Number 1: 48AC8480
FB1 = BLM18PG121SN1D: Ferrite Beads Multi-Layer 120Ohm 25% 100MHz 2A 50mOhm DCR 0603 Paper T/R; Manufacturer: Murata; Material: Steel,Ferrite; Impedance: 120R; Number of Lines: 1; DC Resistance (DCR): 50mR; Number of Circuits: 1NUMBER; Shielding: 202Shielding; Supplier 1: Mouser; Manufacturer Part Number: BLM18PG121SN1D; RoHS: Yes; Category: Ferrite Beads and Chips; Stock 1: 377848; Pricing 1: 1=0.1, 10=0.059, 50=0.047, 100=0.042, 1000=0.029, 10000=0.018 (USD); Case/Package: 0603; Number of Pins: 2; Core Material: Ferrite; Case Code (Metric): 1608; Case Code (Imperial): 0603; Min Operating Temperature: -55°C; Max Operating Temperature: 125°C; Tolerance: 25%; Package Quantity: 1; Max Current Rating: 2A; Packaging: Tape and Reel; Current Rating: 2A; Max DC Current: 2A; Termination: SMD/SMT; Test Frequency: 100MHz; DC Current: 2A; Frequency: 100MHz; Series: BLM18P; DC Resistance-Max: 50mR; RMS Current (Irms): 2A; Series Resistance: 50mR; Length: 1.6mm; Width: 0.8mm; Height: 0.8mm; Depth: 0.8mm; Radiation Hardening: No; Reach SVHC Compliant: No; Lead Free: Lead Free; RoHS Compliant: Yes; ComponentLink1URL: https://datasheet.ciiva.com/5709/1740433-5709171.pdf?src-supplier=Farnell; ComponentLink1Description: https://datasheet.ciiva.com/5709/1740433-5709171.pdf?src-supplier=Farnell; ComponentLink2URL: https://datasheet.ciiva.com/19454/1845013-19454715.pdf?src-supplier=Jameco; ComponentLink2Description: https://datasheet.ciiva.com/19454/1845013-19454715.pdf?src-supplier=Jameco; ComponentLink3URL: https://datasheet.ciiva.com/11799/0900766b81275ca5-11799546.pdf?src-supplier=Rs; ComponentLink3Description: https://datasheet.ciiva.com/11799/0900766b81275ca5-11799546.pdf?src-supplier=Rs; ComponentLink4URL: https://datasheet.ciiva.com/3854/5emiapbde-1-3854039.pdf?src-supplier=Arrow+Electronics; ComponentLink4Description: https://datasheet.ciiva.com/3854/5emiapbde-1-3854039.pdf?src-supplier=Arrow+Electronics; ComponentLink5URL: https://datasheet.ciiva.com/29347/442365-da-01-en-chip-drossel-0603-120r-2000ma-1-6x0-8mm-29347911.pdf?src-supplier=Conrad; ComponentLink5Description: https://datasheet.ciiva.com/29347/442365-da-01-en-chip-drossel-0603-120r-2000ma-1-6x0-8mm-29347911.pdf?src-supplier=Conrad; ComponentLink6URL: https://datasheet.ciiva.com/8021/1740433-8021493.pdf?src-supplier=Element14; ComponentLink6Description: https://datasheet.ciiva.com/8021/1740433-8021493.pdf?src-supplier=Element14; ComponentLink7URL: https://datasheet.ciiva.com/8021/1740433-8021494.pdf?src-supplier=Element14; ComponentLink7Description: https://datasheet.ciiva.com/8021/1740433-8021494.pdf?src-supplier=Element14; ComponentLink8URL: https://datasheet.ciiva.com/14122/blm-series-eng-tds-14122905.pdf?src-supplier=Distrelec; ComponentLink8Description: https://datasheet.ciiva.com/14122/blm-series-eng-tds-14122905.pdf?src-supplier=Distrelec; ComponentLink9URL: https://datasheet.ciiva.com/6212/l0110s0100blm18p-6212502.pdf?src-supplier=Digikey; ComponentLink9Description: https://datasheet.ciiva.com/6212/l0110s0100blm18p-6212502.pdf?src-supplier=Digikey; ComponentLink10URL: https://datasheet.ciiva.com/6212/l0110s0100blm18p-6212504.pdf?src-supplier=Digikey; ComponentLink10Description: https://datasheet.ciiva.com/6212/l0110s0100blm18p-6212504.pdf?src-supplier=Digikey; ComponentLink11URL: https://datasheet.ciiva.com/3081/l0110s0100blm18p-3081632.pdf?src-supplier=Avnet; ComponentLink11Description: https://datasheet.ciiva.com/3081/l0110s0100blm18p-3081632.pdf?src-supplier=Avnet; ComponentLink12URL: https://datasheet.ciiva.com/41449/001172297-da-01-en-drossel-0603-120r-1-6x0-8mm-4000st-41449659.pdf?src-supplier=Conrad; ComponentLink12Description: https://datasheet.ciiva.com/41449/001172297-da-01-en-drossel-0603-120r-1-6x0-8mm-4000st-41449659.pdf?src-supplier=Conrad; Supplier Part Number 1: 81-BLM18PG121SN1D
FB2 FB3 = BLM18KG331SH1D: FERRITE BEAD 330 OHM 0603 1LN; Manufacturer: Murata Electronics; Current Rating (Max): 1.7A; DC Resistance (DCR) (Max): 80mOhm; Filter Type: Power Line; Number of Lines: 1; Part Number: BLM18KG331SH1D; ComponentLink1Description: Datasheet; ComponentLink1URL: https://www.murata.com/en-global/products/productdata/8796737273886/QNFA9101.pdf; ComponentLink2Description: DigiKey Link; ComponentLink2URL: https://www.digikey.com/en/products/detail/murata-electronics/BLM18KG331SH1D/5881246; Device Package: 0603 (1608 Metric); Height (Max): 0.037" (0.95mm); Impedance @ Frequency: 330 Ohms @ 100 MHz; LastUpdated: 3/11/2024 7:43:28 AM; Lifecycle Status: Active; Minimum Order: 1; Mounting Type: Surface Mount; Operating Temperature: -55°C ~ 125°C; Package / Case: 0603 (1608 Metric); Packaging: TapeAndReel; PartId: 932; Part Status: Active; Price: 0.02; Ratings: AEC-Q200; Series: EMIFIL®, BLM18; Size / Dimension: 0.063" L x 0.032" W (1.60mm x 0.80mm); Supplier 1: DigiKey; Supplier Part Number 1: 490-13257-1-ND; Value: 330 Ohms @ 100 MHz
JDC1 = DCIN: Jac DC input; Value: Jac DC
L1 = HCTI-10-20.0: High Current Toroidal Inductor | 10 uH; MF: Signal Transformer; SnapEDA_Link: https://www.snapeda.com/parts/HCTI-10-20.0/Signal+Transformer/view-part/?ref=snap; Package: Radial Bel Fuse; Value: *; MP: HCTI-10-20.0; Check_prices: https://www.snapeda.com/parts/HCTI-10-20.0/Signal+Transformer/view-part/?ref=eda
Q1 Q2 = IRLB8721PBF: IRLB8721PBF N-channel MOSFET Transistor, 62 A, 30 V, 3-Pin TO-220AB | Infineon IRLB8721PBF; MF: Infineon Technologies; SnapEDA_Link: https://www.snapeda.com/parts/IRLB8721PBF/Infineon/view-part/?ref=snap; Package: TO-220-3 Infineon; Value: *; MP: IRLB8721PBF; Check_prices: https://www.snapeda.com/parts/IRLB8721PBF/Infineon/view-part/?ref=eda
R1-R6 = RESCHP0427 165K 1% 0603 SMD: RES CHP 165K 1% 1/10W 0603 SMD; LINE: SMT; UNIT: PCS; TMG PN: RESCHP0167; TMG CODE: None; CERTIFICATION: NA; CLASS: B; MOUNT: SMD; TYPE: EP; ComponentLink1Description: Datasheet; ComponentLink1URL: https://datasheet.lcsc.com/lcsc/2304140030_YAGEO-RT0603FRD07100RL_C160603.pdf; Footprint: 0603
R7 = Resistor 2.2K: as R8 on sheet CANTRICK MCU; Supplier 1: Arrow Electronics; RoHS: Yes; Category: Chip SMD Resistors; Stock 1: 130000; Pricing 1: 5000=0.0053 (USD); Case/Package: 0603; Weight: 7.1E-05oz; Case Code (Metric): 1608; Case Code (Imperial): 0603; Contact Plating: Tin; Size Code: 0603; Min Operating Temperature: -55°C; Max Operating Temperature: 155°C; Package Quantity: 5000; Tolerance: 5%; Packaging: Tape and Reel; Resistor Type: Thick Film; Number of Terminations: 2; Temperature Coefficient: 200ppm/°C; Termination: SMD/SMT; Max Power Dissipation: 100mW; Features: Automotive AEC-Q200; Series: CRCW; Resistance Tolerance: 5%; Construction: Rectangular; Length: 1.55mm; Width: 0.85mm; Height: 0.45mm; Depth: 0.85mm; Ratings: AEC-Q200; Radiation Hardening: No; Military Standard: Not; RoHS Compliant: Yes; Reach SVHC Compliant: Unknown; Lead Free: 5697LeadFree; ComponentLink1URL: https://datasheet.ciiva.com/2462/dcrcwe3-2462048.pdf?src-supplier=Digikey; ComponentLink1Description: https://datasheet.ciiva.com/2462/dcrcwe3-2462048.pdf?src-supplier=Digikey; ComponentLink2URL: https://datasheet.ciiva.com/16767/70201119-16767464.pdf?src-supplier=Allied+Electronics; ComponentLink2Description: https://datasheet.ciiva.com/16767/70201119-16767464.pdf?src-supplier=Allied+Electronics; ComponentLink3URL: https://datasheet.ciiva.com/2462/dcrcwe3-2462046.pdf?src-supplier=Digikey; ComponentLink3Description: https://datasheet.ciiva.com/2462/dcrcwe3-2462046.pdf?src-supplier=Digikey; ComponentLink4URL: https://datasheet.ciiva.com/5541/dcrcwe3-109170-5541959.pdf?src-supplier=Mouser; ComponentLink4Description: https://datasheet.ciiva.com/5541/dcrcwe3-109170-5541959.pdf?src-supplier=Mouser; ComponentLink5URL: https://datasheet.ciiva.com/16286/dcrcwe3-16286997.pdf?src-supplier=Future+Electronics; ComponentLink5Description: https://datasheet.ciiva.com/16286/dcrcwe3-16286997.pdf?src-supplier=Future+Electronics; Supplier Part Number 1: CRCW06032K20JNEA
U1 = TPS40305DRCT: 3-V to 20-V, 25-A, 1.2-MHz synchronous buck controller with FSS; MF: Texas Instruments; SnapEDA_Link: https://www.snapeda.com/parts/TPS40305DRCT/Texas+Instruments/view-part/?ref=snap; Package: VSON-10 Texas Instruments; Value: *; MP: TPS40305DRCT; Check_prices: https://www.snapeda.com/parts/TPS40305DRCT/Texas+Instruments/view-part/?ref=eda
U2 = AMS1117: 1A LOW DROPOUT VOLTAGE REGULATOR SOT-223; MF: Advanced Monolithic Systems; Price: None; Availability: Not in stock; Package: SOT-223 Seeed Technology; MP: AMS1117; Value: *; SnapEDA_Link: https://www.snapeda.com/parts/AMS1117/Advanced+Monolithic+Systems/view-part/?ref=snap; Check_prices: https://www.snapeda.com/parts/AMS1117/Advanced+Monolithic+Systems/view-part/?ref=eda

## Sheet COVER PAGE.SchDoc
size A3; SheetNumber: 2; SheetTotal: 5
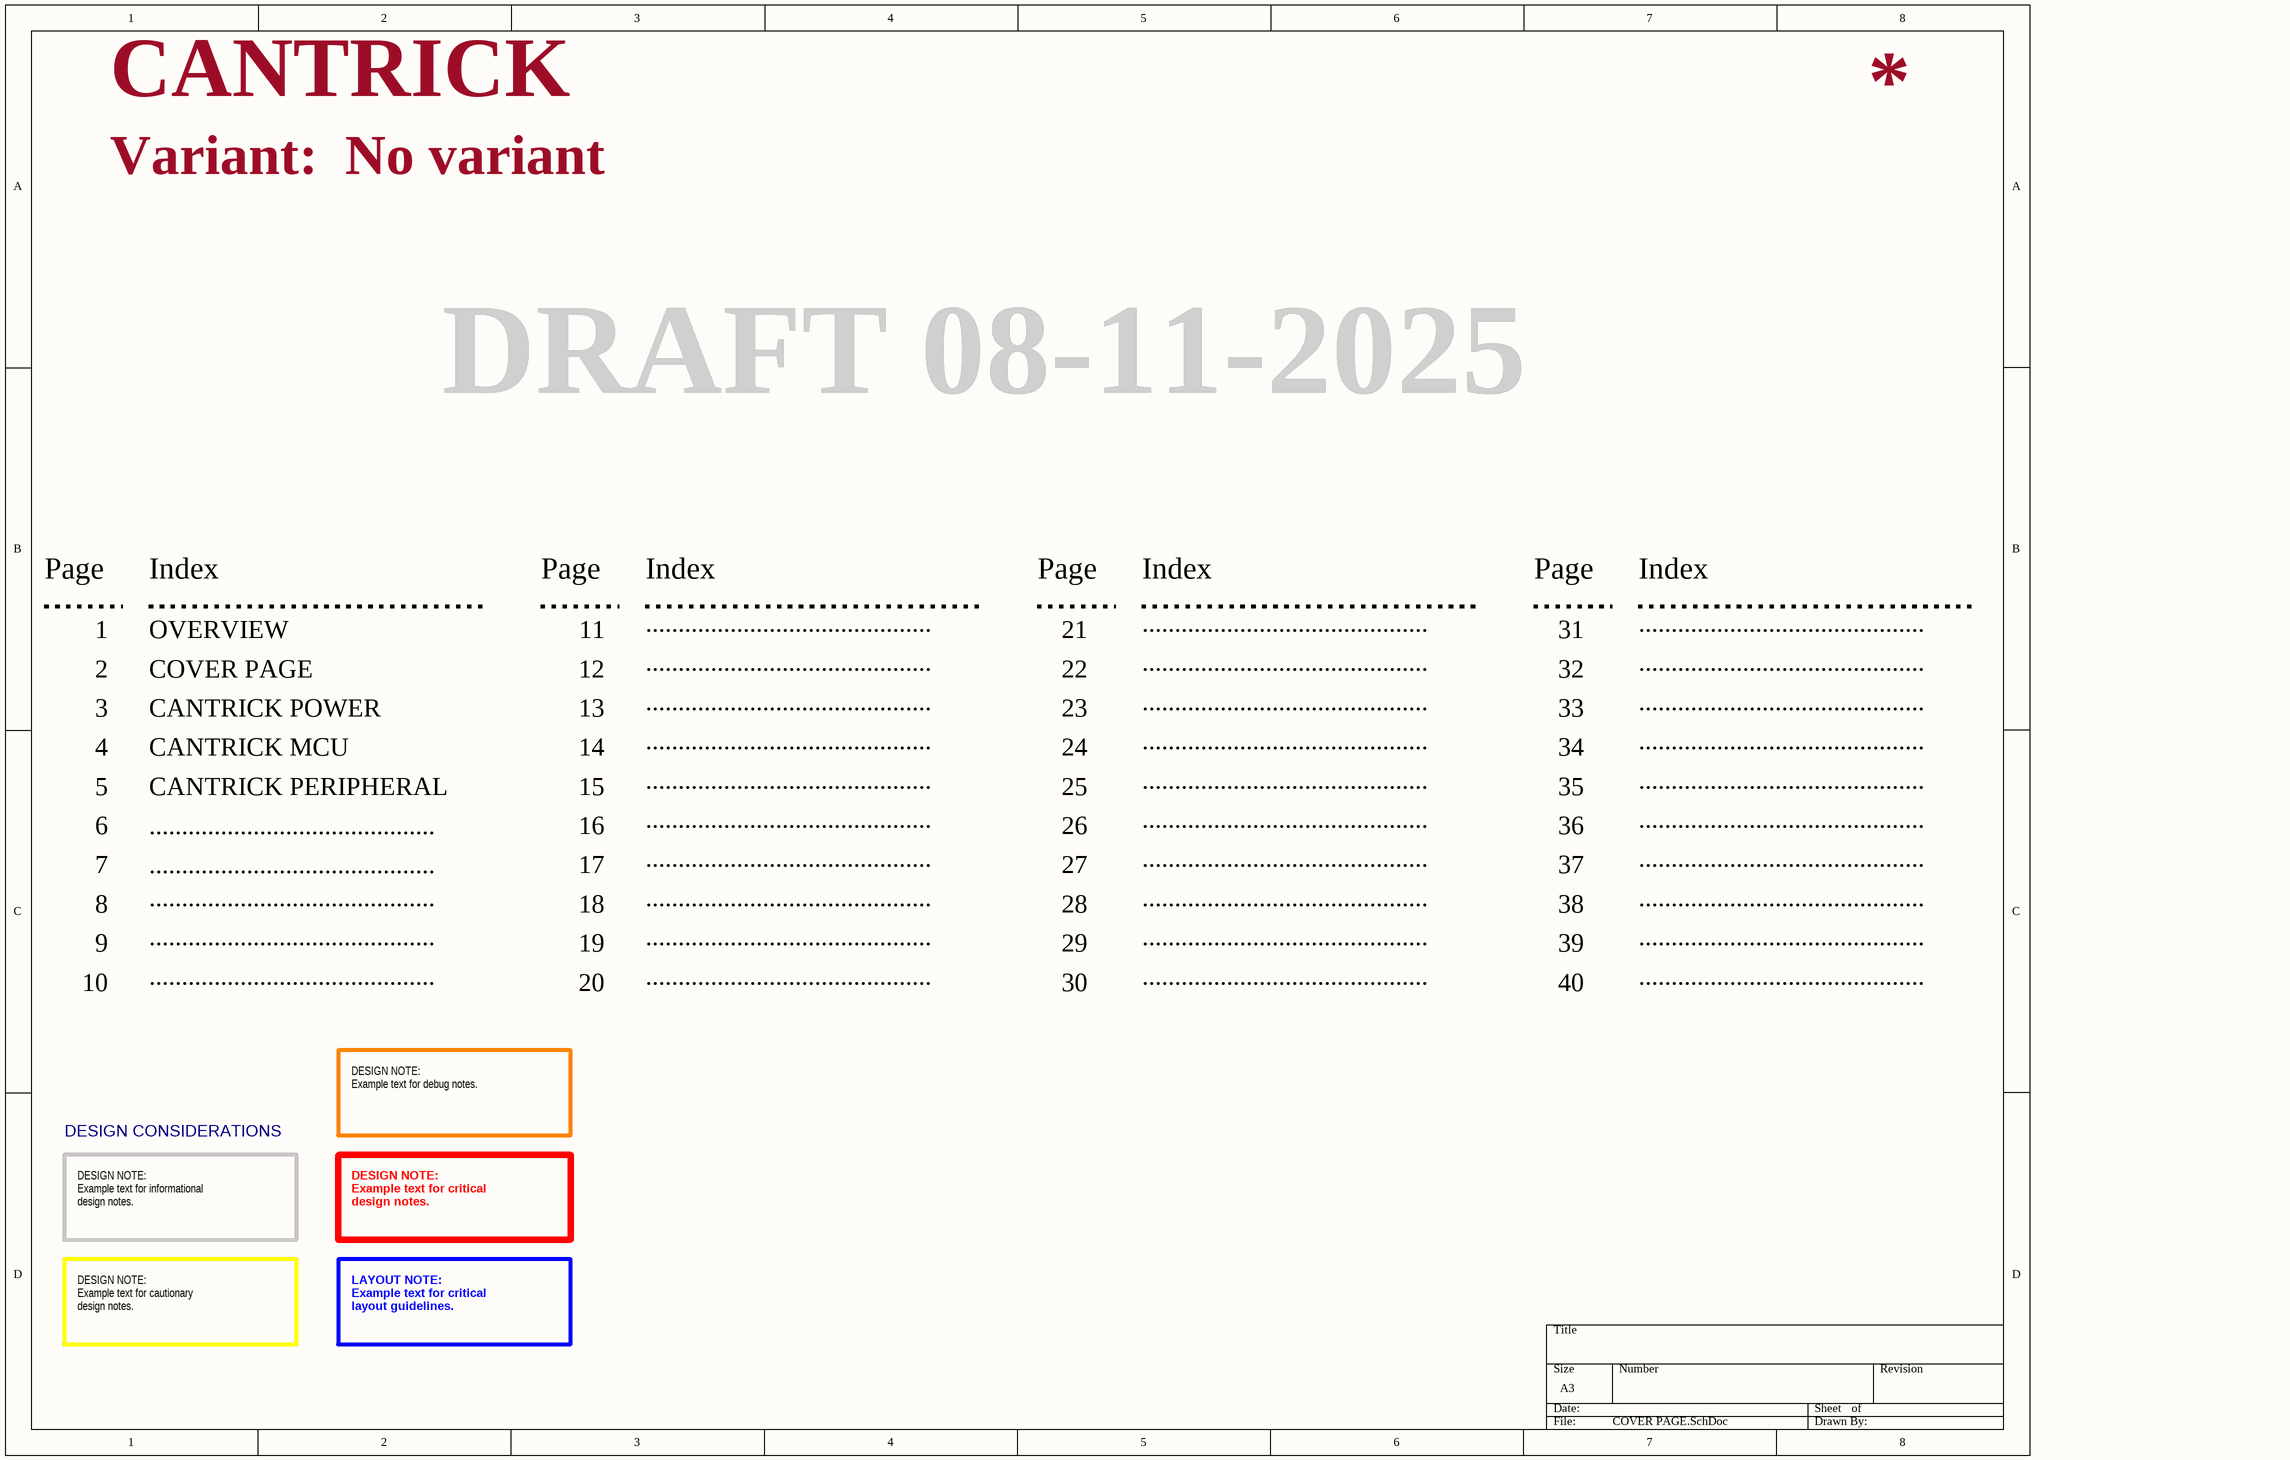
[diagram p4: COVER PAGE.SchDoc]

### Notes on the sheet
- CANTRICK
- Variant:
- No variant
- DRAFT 08-11-2025
- Page
- Index
- 1
- 2
- OVERVIEW
- COVER PAGE
- 12
- 11
- ............................................
- 21
- 22
- 31
- 32
- 3
- 4
- CANTRICK POWER
- CANTRICK MCU
- 13
- 14
- 23
- 24
- 33
- 34
- 5
- CANTRICK PERIPHERAL
- 15
- 25
- 35
- 6
- 7
- 16
- 17
- 26
- 27
- 36
- 37
- 8
- 9
- 18
- 19
- 28
- 29
- 38
- 39
- 10
- 20
- 30
- 40
- DESIGN CONSIDERATIONS
- DESIGN NOTE:
  Example text for debug notes.
- DESIGN NOTE:
  Example text for informational
  design notes.
- DESIGN NOTE:
  Example text for critical
  design notes.
- DESIGN NOTE:
  Example text for cautionary
  design notes.
- LAYOUT NOTE:
  Example text for critical
  layout guidelines.

## Nets that join several sheets
+5V: CANTRICK MCU (J1.1), CANTRICK PERIPHERAL (6 pins), CANTRICK POWER (10 pins)
+12V: CANTRICK PERIPHERAL (C1.1 U5.5), CANTRICK POWER (F1.1 JDC1.1)
D3V3: CANTRICK MCU (11 pins), CANTRICK PERIPHERAL (12 pins), CANTRICK POWER (C18.2 C19.1 FB3.2)
GND: CANTRICK MCU (40 pins), CANTRICK PERIPHERAL (19 pins), CANTRICK POWER (25 pins)
CS2_CAN: CANTRICK MCU (U4.27), CANTRICK PERIPHERAL (J6.16)
CS_CAN: CANTRICK MCU (R11.1 U4.26), CANTRICK PERIPHERAL (J2.16)
DIR: CANTRICK MCU (U4.11), CANTRICK PERIPHERAL (U5.3)
EN: CANTRICK MCU (U4.12), CANTRICK PERIPHERAL (U5.2)
INT_CAN: CANTRICK MCU (R10.1 U4.29), CANTRICK PERIPHERAL (J2.12)
LED1: CANTRICK MCU (U4.16), CANTRICK PERIPHERAL (J4.2)
LED2: CANTRICK MCU (R15.2 U4.14), CANTRICK PERIPHERAL (J5.2)
MISO_CAN: CANTRICK MCU (U4.31), CANTRICK PERIPHERAL (J2.15 J6.15)
MOSI_CAN: CANTRICK MCU (U4.37), CANTRICK PERIPHERAL (J2.14 J6.14)
nFAULT: CANTRICK MCU (U4.6), CANTRICK PERIPHERAL (R24.2 U5.4)
SCK_CAN: CANTRICK MCU (U4.30), CANTRICK PERIPHERAL (J2.13 J6.13)